# Altium schematic sheet YUsendQB50-TopLevel.SchDoc: Top Level YUsend-QB50 (CA01)
size C; DrawnBy: H. Chesser
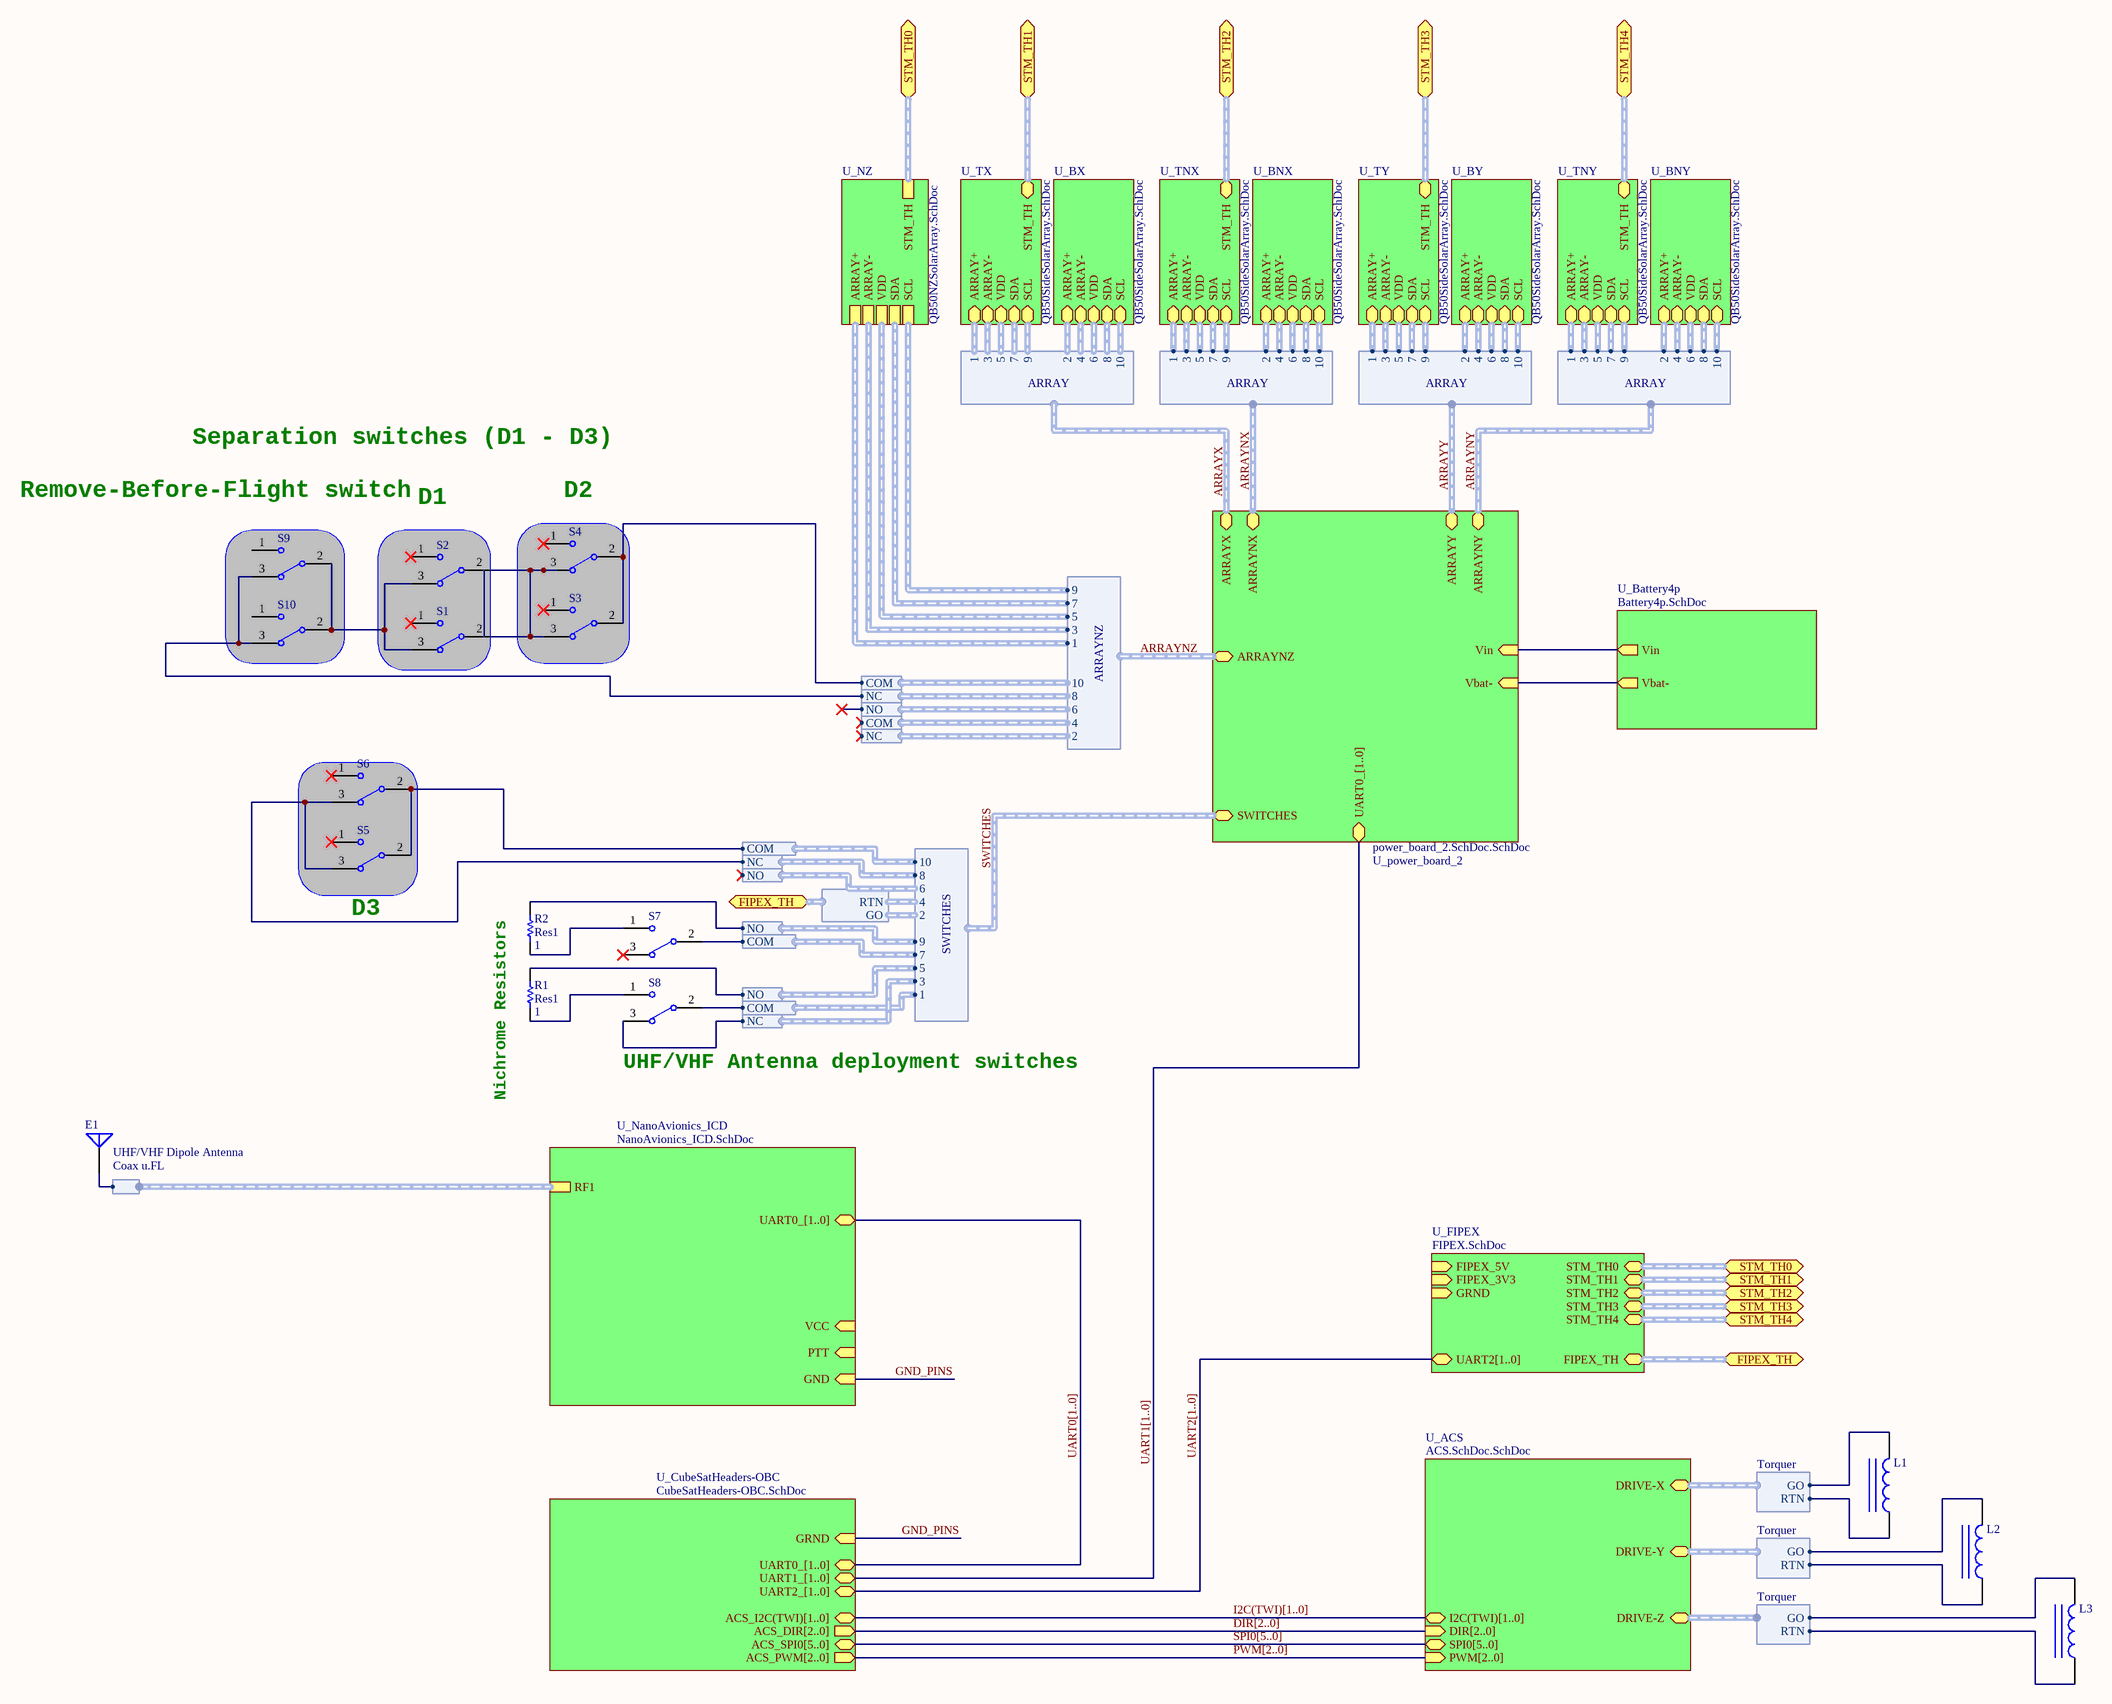
[diagram p0: YUsendQB50-TopLevel.SchDoc]

## Parts
E1  UHF/VHF Dipole Antenna  [PIN1]
L1  Inductor Iron  [AXIAL-0.9]  (value not drawn)
L2  Inductor Iron  [AXIAL-0.9]  (value not drawn)
L3  Inductor Iron  [AXIAL-0.9]  (value not drawn)
R1  Res1  value 1  [AXIAL-0.3]
R2  Res1  value 1  [AXIAL-0.3]
S1  SW-SPDT  [TL36WW15050]  (value not drawn)
S2  SW-SPDT  [TL36WW15050]  (value not drawn)
S3  SW-SPDT  [TL36WW15050]  (value not drawn)
S4  SW-SPDT  [TL36WW15050]  (value not drawn)
S5  SW-SPDT  [TL36WW15050]  (value not drawn)
S6  SW-SPDT  [TL36WW15050]  (value not drawn)
S7  SW-SPDT  [TL36WW15050]  (value not drawn)
S8  SW-SPDT  [TL36WW15050]  (value not drawn)
S9  SW-SPDT  [TL36WW15050]  (value not drawn)
S10  SW-SPDT  [TL36WW15050]  (value not drawn)

## Sub-sheets
U_ACS = ACS.SchDoc.SchDoc: I2C(TWI)[1..0] (bidir), PWM[2..0] (in), DRIVE-X (harness Torquer), DRIVE-Y (harness Torquer), DRIVE-Z (harness Torquer), DIR[2..0] (in), SPI0[5..0] (bidir)
U_Battery4p = Battery4p.SchDoc: Vbat- (out), Vin (out)
U_BNX = QB50SideSolarArray.SchDoc: ARRAY+ (harness ARRAY+), ARRAY- (harness ARRAY-), VDD (harness VDD), SDA (harness SDA), SCL (harness SCL)
U_BNY = QB50SideSolarArray.SchDoc: ARRAY+ (harness ARRAY+), ARRAY- (harness ARRAY-), VDD (harness VDD), SDA (harness SDA), SCL (harness SCL)
U_BX = QB50SideSolarArray.SchDoc: ARRAY+ (harness ARRAY+), ARRAY- (harness ARRAY-), VDD (harness VDD), SDA (harness SDA), SCL (harness SCL)
U_BY = QB50SideSolarArray.SchDoc: ARRAY+ (harness ARRAY+), ARRAY- (harness ARRAY-), VDD (harness VDD), SDA (harness SDA), SCL (harness SCL)
U_CubeSatHeaders-OBC = CubeSatHeaders-OBC.SchDoc: UART0_[1..0] (bidir), UART1_[1..0] (bidir), GRND (in), UART2_[1..0] (bidir), ACS_I2C(TWI)[1..0] (bidir), ACS_DIR[2..0] (out), ACS_PWM[2..0] (out), ACS_SPI0[5..0] (bidir)
U_FIPEX = FIPEX.SchDoc: UART2[1..0] (bidir), GRND (in), FIPEX_3V3 (in), FIPEX_5V (in), STM_TH0 (harness STM_TH), STM_TH2 (harness STM_TH), STM_TH3 (harness STM_TH), STM_TH4 (harness STM_TH), FIPEX_TH (harness STM_TH), STM_TH1 (harness STM_TH)
U_NanoAvionics_ICD = NanoAvionics_ICD.SchDoc: UART0_[1..0] (bidir), VCC (in), RF1 (harness Coax u.FL), PTT (in), GND (in)
U_NZ = QB50NZSolarArray.SchDoc: ARRAY+ (harness ARRAY+), ARRAY- (harness ARRAY-), VDD (harness VDD), SDA (harness SDA), SCL (harness SCL), STM_TH (harness STM_TH)
U_power_board_2 = power_board_2.SchDoc.SchDoc: UART0_[1..0] (bidir), ARRAYX (harness ARRAY), ARRAYNX (harness ARRAY), ARRAYY (harness ARRAY), ARRAYNY (harness ARRAY), ARRAYNZ (harness ARRAYNZ), SWITCHES (harness SWITCHES), Vin (in), Vbat- (in)
U_TNX = QB50SideSolarArray.SchDoc: ARRAY+ (harness ARRAY+), ARRAY- (harness ARRAY-), VDD (harness VDD), SDA (harness SDA), SCL (harness SCL), STM_TH (harness STM_TH)
U_TNY = QB50SideSolarArray.SchDoc: ARRAY+ (harness ARRAY+), ARRAY- (harness ARRAY-), VDD (harness VDD), SDA (harness SDA), SCL (harness SCL), STM_TH (harness STM_TH)
U_TX = QB50SideSolarArray.SchDoc: ARRAY+ (harness ARRAY+), ARRAY- (harness ARRAY-), VDD (harness VDD), SDA (harness SDA), SCL (harness SCL), STM_TH (harness STM_TH)
U_TY = QB50SideSolarArray.SchDoc: ARRAY+ (harness ARRAY+), ARRAY- (harness ARRAY-), VDD (harness VDD), SDA (harness SDA), SCL (harness SCL), STM_TH (harness STM_TH)

## Ports
FIPEX_TH, FIPEX_TH (harness STM_TH), STM_TH0, STM_TH1, STM_TH2, STM_TH3, STM_TH4

## Harnesses
ARRAY: 1, 3, 5, 7, 9, 2, 4, 6, 8, 10
ARRAY: 1, 10, 2, 3, 4, 5, 6, 7, 8, 9
ARRAYNZ: 1, 10, 2, 3, 4, 5, 6, 7, 8, 9
SEPCOM: COM
SEPNC: NC
COM: COM
NC: NC
NO: NO
SWITCHES: 1, 10, 2, 3, 4, 5, 6, 7, 8, 9
STM_TH: GO, RTN
Torquer: GO, RTN
Coax u.FL: 

## Nets
GND_PINS: sheet U_CubeSatHeaders-OBC/GRND, sheet U_NanoAvionics_ICD/GND
NetE1_1: E1.1(A) ; sheet U_NanoAvionics_ICD/RF1.
NetL1_1: L1.1 ; sheet U_ACS/DRIVE-X.RTN
NetL1_2: L1.2 ; sheet U_ACS/DRIVE-X.GO
NetL2_1: L2.1 ; sheet U_ACS/DRIVE-Y.RTN
NetL2_2: L2.2 ; sheet U_ACS/DRIVE-Y.GO
NetL3_1: L3.1 ; sheet U_ACS/DRIVE-Z.RTN
NetL3_2: L3.2 ; sheet U_ACS/DRIVE-Z.GO
NetR1_1: R1.1 S8.1
NetR1_2: R1.2 ; harness NO.NO
NetR2_1: R2.1 S7.1
NetR2_2: R2.2 ; harness NO.NO
NetS1_2: S1.2 S2.2 S3.3 S4.3
NetS1_3: S1.3 S2.3 S9.2 S10.2
NetS3_2: S3.2 S4.2 ; harness SEPCOM.COM
NetS5_2: S5.2 S6.2 ; harness COM.COM
NetS5_3: S5.3 S6.3 ; harness NC.NC
NetS7_2: S7.2 ; harness COM.COM
NetS8_2: S8.2 ; harness COM.COM
NetS8_3: S8.3 ; harness NC.NC
NetS9_3: S9.3 S10.3 ; harness SEPNC.NC
(unnamed): sheet U_power_board_2/Vin, sheet U_Battery4p/Vin
(unnamed): sheet U_power_board_2/Vbat-, sheet U_Battery4p/Vbat-

Not connected (* = marked no-connect by the designer): S1 1*; S2 1*; S3 1*; S4 1*; S5 1*; S6 1*; S7 3*; S9 1; S10 1

## Buses and harness runs
bus DIR[2..0] = sheet U_ACS/DIR[2..0] = sheet U_CubeSatHeaders-OBC/ACS_DIR[2..0]
bus I2C(TWI)[1..0] = sheet U_ACS/I2C(TWI)[1..0] = sheet U_CubeSatHeaders-OBC/ACS_I2C(TWI)[1..0]
bus PWM[2..0] = sheet U_ACS/PWM[2..0] = sheet U_CubeSatHeaders-OBC/ACS_PWM[2..0]
bus SPI0[5..0] = sheet U_ACS/SPI0[5..0] = sheet U_CubeSatHeaders-OBC/ACS_SPI0[5..0]
bus UART0[1..0] = sheet U_CubeSatHeaders-OBC/UART0_[1..0] = sheet U_NanoAvionics_ICD/UART0_[1..0]
bus UART1[1..0] = sheet U_CubeSatHeaders-OBC/UART1_[1..0] = sheet U_power_board_2/UART0_[1..0]
bus UART2[1..0] = sheet U_CubeSatHeaders-OBC/UART2_[1..0] = sheet U_FIPEX/UART2[1..0]
harness ARRAYNX = sheet U_power_board_2/ARRAYNX
harness ARRAYNY = sheet U_power_board_2/ARRAYNY
harness ARRAYNZ = sheet U_power_board_2/ARRAYNZ
harness ARRAYX = sheet U_power_board_2/ARRAYX
harness ARRAYY = sheet U_power_board_2/ARRAYY
harness port FIPEX_TH = sheet U_FIPEX/FIPEX_TH
harness port STM_TH0 = sheet U_FIPEX/STM_TH0
harness port STM_TH0 = sheet U_NZ/STM_TH
harness port STM_TH1 = sheet U_FIPEX/STM_TH1
harness port STM_TH1 = sheet U_TX/STM_TH
harness port STM_TH2 = sheet U_FIPEX/STM_TH2
harness port STM_TH2 = sheet U_TNX/STM_TH
harness port STM_TH3 = sheet U_FIPEX/STM_TH3
harness port STM_TH3 = sheet U_TY/STM_TH
harness port STM_TH4 = sheet U_FIPEX/STM_TH4
harness port STM_TH4 = sheet U_TNY/STM_TH
harness SWITCHES = sheet U_power_board_2/SWITCHES

## Notes on the sheet
- Separation switches (D1 - D3)
- (near S9) Remove-Before-Flight switch
- (near S2) D1
- (near S4) D2
- (near S5) D3
- Nichrome Resistors
- (near S8) UHF/VHF Antenna deployment switches

## Library data of the parts
E1 = Antenna: Generic Antenna; Published: 24-Mar-1999; LatestRevisionDate: 17-Jul-2002; LatestRevisionNote: Re-released for DXP Platform.; PackageReference: PIN1; Publisher: Altium Limited
L1-L3 = Inductor Iron: Magnetic-Core Inductor; Value: 10mH; Published: 24-Mar-1999; LatestRevisionDate: 17-Jul-2002; LatestRevisionNote: Re-released for DXP Platform.; PackageReference: AXIAL-0.9; Publisher: Altium Limited; PackageDescription: Axial Device, Thru-Hole; 2 Leads; 0.9 in Pin Spacing
R1 R2 = Res1: Resistor; Published: 8-Jun-2000; LatestRevisionDate: 17-Jul-2002; LatestRevisionNote: Re-released for DXP Platform.; PackageReference: AXIAL-0.3; Publisher: Altium Limited; PackageDescription: Axial Device, Thru-Hole; 2 Leads; 0.3 in Pin Spacing
S1-S10 = SW-SPDT: SPDT Subminiature Toggle Switch, Right Angle Mounting, Vertical Actuation; Published: 24-Mar-1999; LatestRevisionDate: 17-Dec-2003; LatestRevisionNote: Schematic revised, PCB Footprint replaced.; DatasheetVersion: 05-Dec-2000; PackageReference: TL36WW15050; Publisher: Altium Limited; PackageDescription: Switch; 4 Leads; ComponentLink1Description: Manufacturer Link; ComponentLink1URL: http://www.apem.com; Supplier 1: Digi-Key; Supplier Part Number 1: 255-3400-ND